# EAGLE design trb-1_v1 (EAGLE 7.4.0)
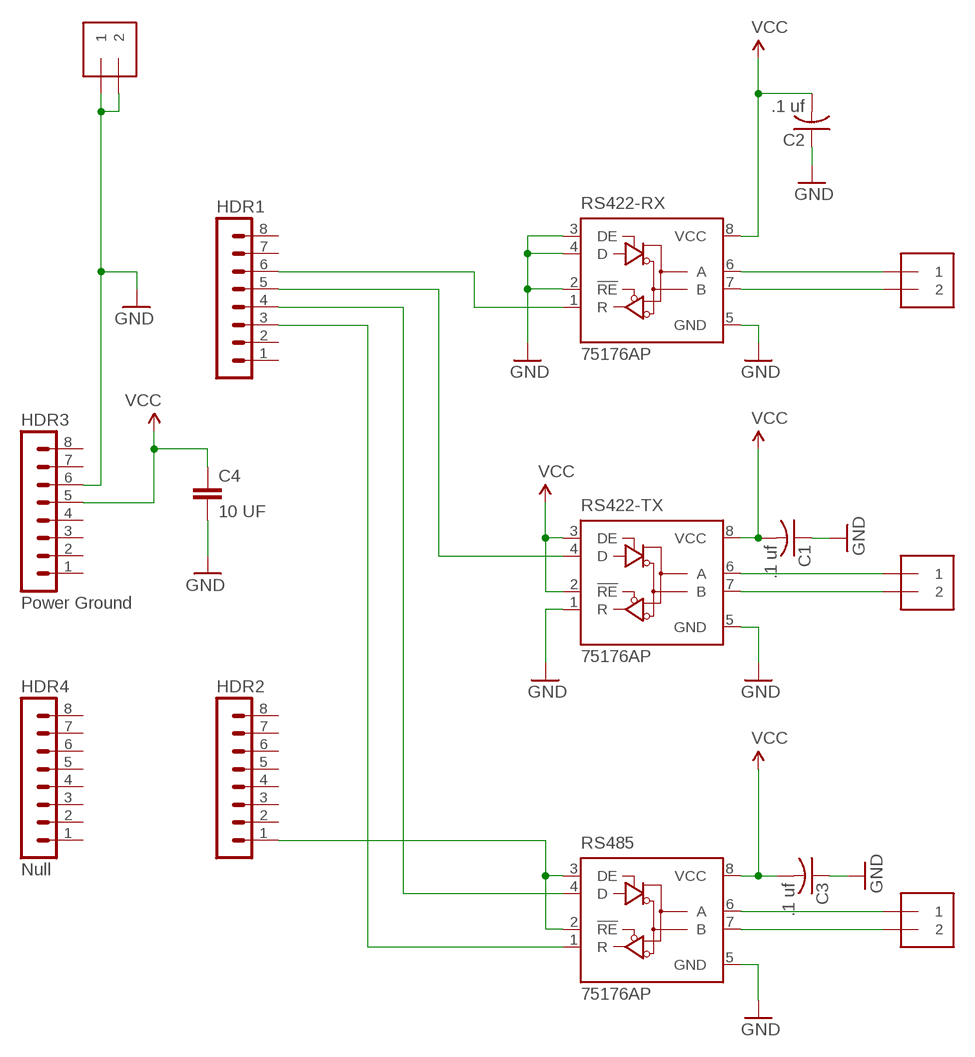
[diagram p0: schematic, sheet 1]

## Parts
C1  .1 uf  C-USC0805  [C0805]
C2  .1 uf  C-USC0805  [C0805]
C3  .1 uf  C-USC0805  [C0805]
C4  10 UF  10UF10V10%(0805)  [0805-CAP]
HDR1  MA08-1  [MA08-1]
HDR2  MA08-1  [MA08-1]
HDR3  Power Ground  MA08-1  [MA08-1]
HDR4  Null  MA08-1  [MA08-1]
J1  1X2-3.5MM  [1X2-3.5MM]
RS422-RX  75176AP  [DIL08]
RS422-RX1  1X2-3.5MM  [1X2-3.5MM]
RS422-TX  75176AP  [DIL08]
RS422-TX1  1X2-3.5MM  [1X2-3.5MM]
RS485  75176AP  [DIL08]
RS485-TXRX  1X2-3.5MM  [1X2-3.5MM]

## Nets
GND: C1.1 C2.1 C3.1 C4.2 HDR3.6 J1.1 J1.2 RS422-RX.2(!RE) RS422-RX.3(DE) RS422-RX.4(D) RS422-RX.5(GND) RS422-TX.1(R) RS422-TX.5(GND) RS485.5(GND)
N$1: HDR1.3 RS485.1(R)
N$2: HDR1.4 RS485.4(D)
N$3: HDR1.5 RS422-TX.4(D)
N$4: HDR1.6 RS422-RX.1(R)
N$5: HDR2.1 RS485.2(!RE) RS485.3(DE)
N$6: RS422-RX1.1 RS422-RX.6(A)
N$7: RS422-RX1.2 RS422-RX.7(B)
N$8: RS422-TX1.1 RS422-TX.6(A)
N$9: RS422-TX1.2 RS422-TX.7(B)
N$10: RS485-TXRX.1 RS485.6(A)
N$11: RS485-TXRX.2 RS485.7(B)
VCC: C1.2 C2.2 C3.2 C4.1 HDR3.5 RS422-RX.8(VCC) RS422-TX.2(!RE) RS422-TX.3(DE) RS422-TX.8(VCC) RS485.8(VCC)
Unconnected: HDR1.1 HDR1.2 HDR1.7 HDR1.8 HDR2.2 HDR2.3 HDR2.4 HDR2.5 HDR2.6 HDR2.7 HDR2.8 HDR3.1 HDR3.2 HDR3.3 HDR3.4 HDR3.7 HDR3.8 HDR4.1 HDR4.2 HDR4.3 HDR4.4 HDR4.5 HDR4.6 HDR4.7 HDR4.8

## Library data of the parts
C1-C3 = resistor:C-US: CAPACITOR, American symbol
C4 = SparkFun-Capacitors:10UF10V10%(0805): CAP-11330; PROD_ID: CAP-11330
HDR1-HDR4 = con-lstb:MA08-1: PIN HEADER; OC_FARNELL: unknown; OC_NEWARK: unknown
J1 RS422-RX1 RS422-TX1 RS485-TXRX = adafruit:1X2: 3.5mm Terminal block http://www.ladyada.net/library/pcb/eaglelibrary.html
RS422-RX RS422-TX RS485 = 751xx:75176A: DIFFERENTIAL BUS TRANSCEIVER Source: http://focus.ti.com/lit/ds/symlink/sn75176a.pdf; MF: TEXAS INSTRUMENTS; MPN: SN75176AP; OC_NEWARK: 08F8125

## Net classes
0 default: width 0.305 mm, drill 0.508 mm, clearance 0.305 mm

## Board
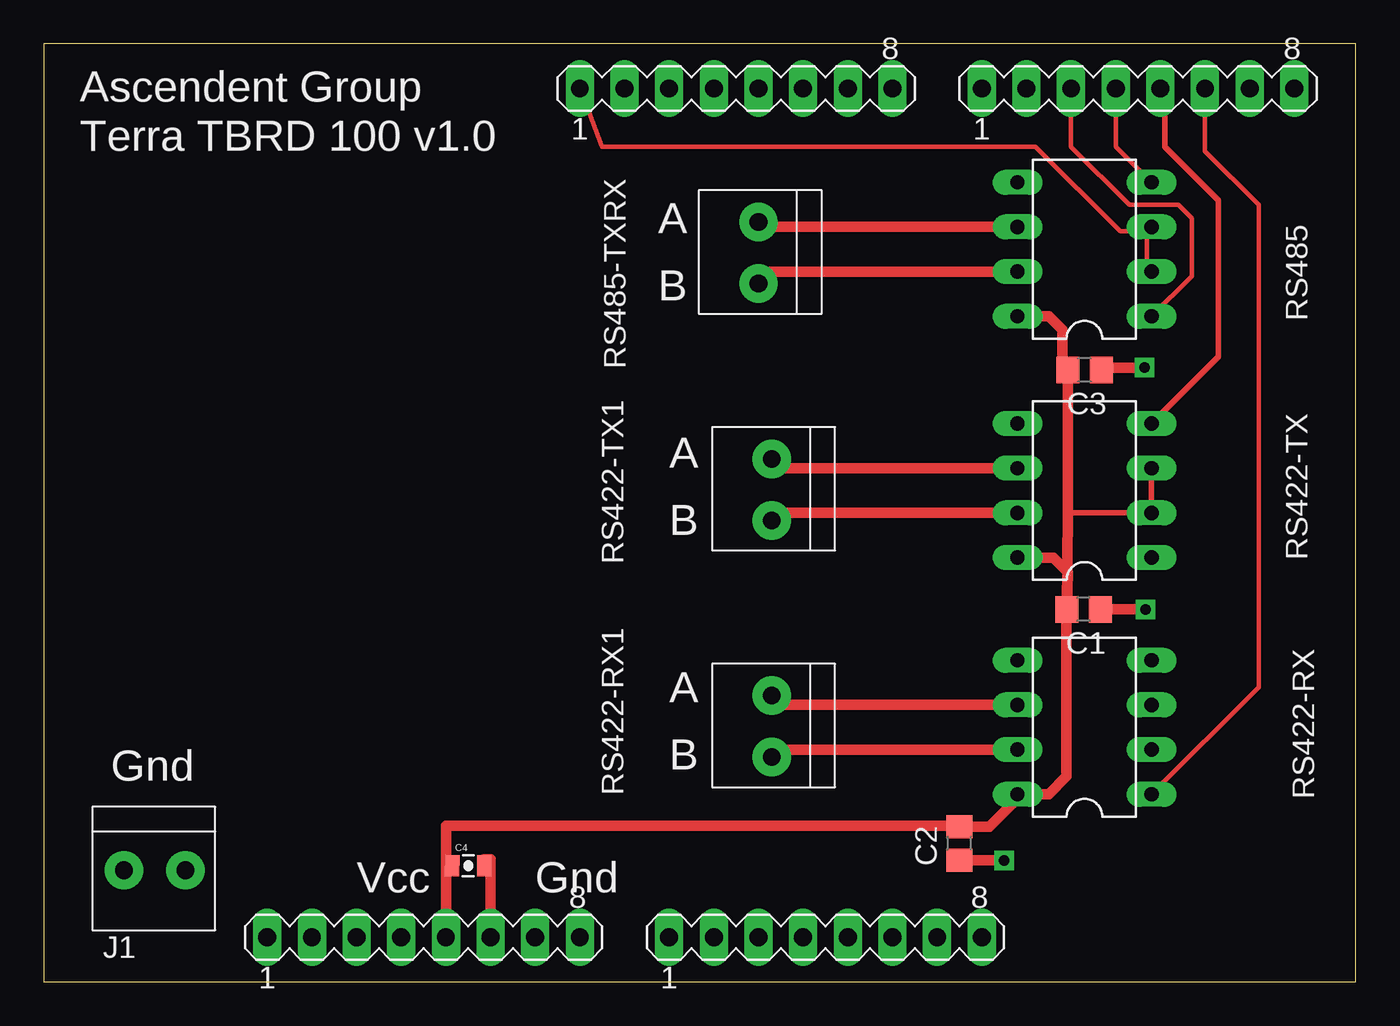
[diagram p1: board, top side]
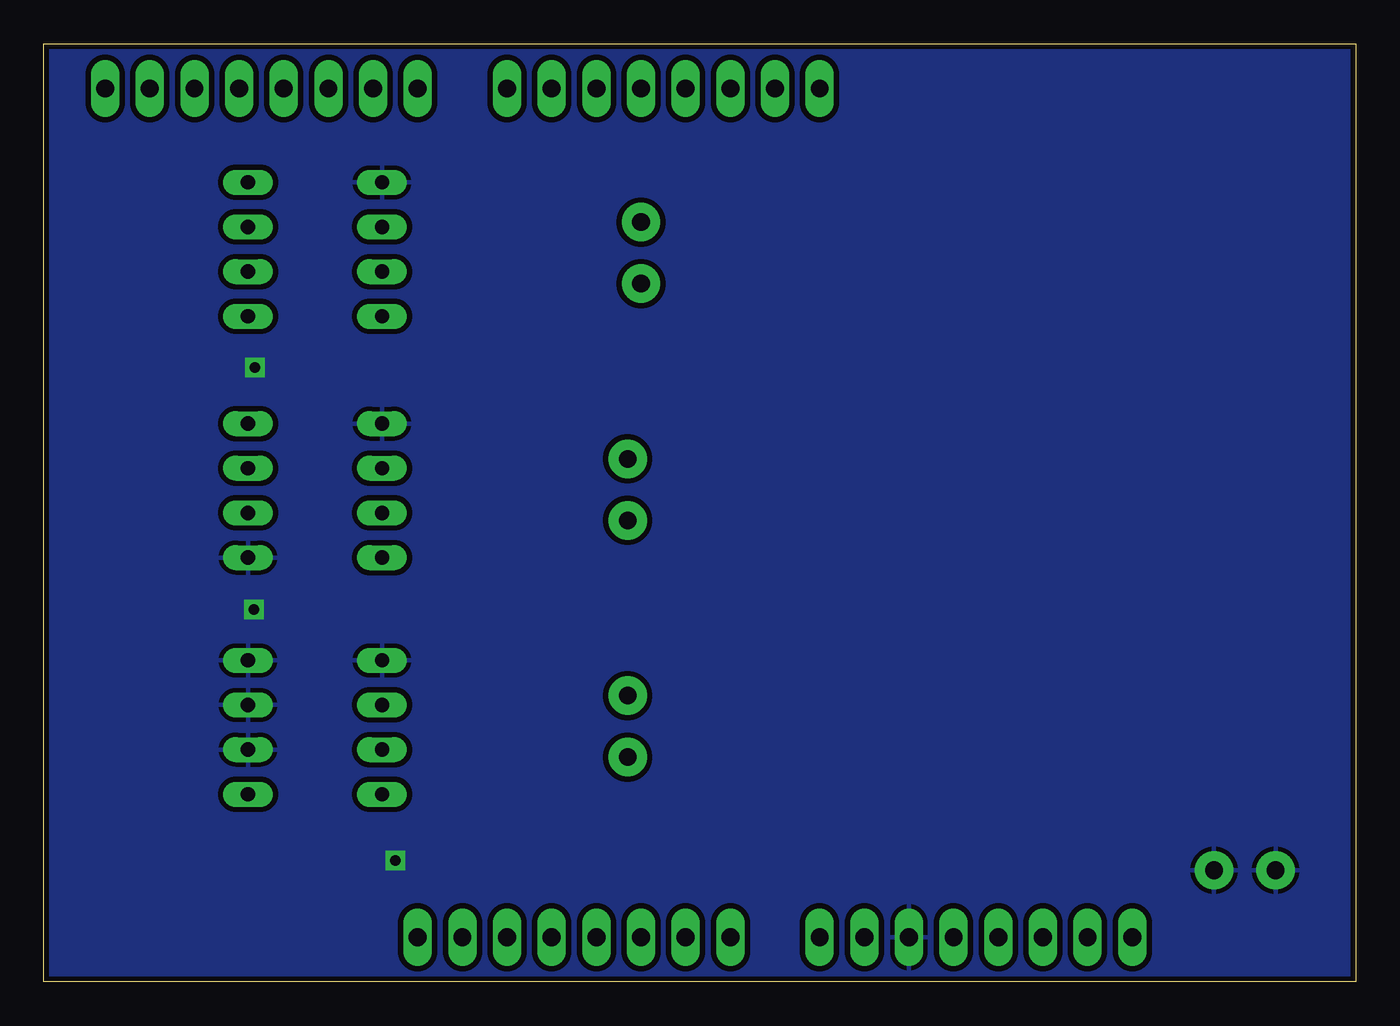
[diagram p2: board, bottom side, seen from below]

Size 74.6 x 53.33 mm. Coordinates in mm from the lower left corner, seen from the top.
Outline: 0,0 74.6,0 74.6,53.33 0,53.33 0,0
Copper layers (1*16): Top 0.035mm / dielectric 1.5mm / Bottom 0.035mm
Design rules "SparkFun": minimum track width 8mil, minimum drill 20mil, track to track 8mil, track to pad 8mil, pad to pad 8mil, via to via 8mil, smd to smd 8mil, copper to edge 10mil, drill to drill 8mil, minimum pad ring 12mil, minimum via ring 10mil, stop-mask expansion 4mil, vias tented up to drill 25mil, thermal gap 10mil

### Footprints (pad centres in the part's own frame; a part is rotated, then mirrored left to right if it is on the bottom)
C0805 = smd 1.3 x 1.5: 1 -0.95,0; 2 0.95,0
0805-CAP = smd 0.8 x 1.2: 1 -0.9,0; 2 0.9,0
MA08-1 = drill 1.016 long: 1 -8.89,0; 2 -6.35,0; 3 -3.81,0; 4 -1.27,0; 5 1.27,0; 6 3.81,0; 7 6.35,0; 8 8.89,0
1X2-3.5MM = drill 1 pad 2.184: 1 1.8,0; 2 -1.7,0
DIL08 = drill 0.813 long: 1 -3.81,-3.81; 2 -1.27,-3.81; 3 1.27,-3.81; 4 3.81,-3.81; 5 3.81,3.81; 6 1.27,3.81; 7 -1.27,3.81; 8 -3.81,3.81

### Placement (x,y rotation side)
C1  59.13,21.18 180 top
C2  52.07,7.87 90 top
C3  59.18,34.8 180 top
C4  24.13,6.6 359.4 top
HDR1  62.23,50.8 0 top
HDR2  39.37,50.8 0 top
HDR3  21.59,2.54 0 top
HDR4  44.45,2.54 0 top
J1  6.35,6.35 180 top
RS422-RX  59.18,14.48 90 top
RS422-RX1  41.4,14.48 90 top
RS422-TX  59.18,27.94 90 top
RS422-TX1  41.4,27.94 90 top
RS485  59.18,41.66 90 top
RS485-TXRX  40.64,41.4 90 top

### Tracks (layer width: path | path; a pad name or v marks a point on that pad's centre or on a via)
GND  (via drill 0.6)
  Top 0.61: C2.1 53.58,6.92 v54.61,6.91 | v62.66,21.18 C1.1 | HDR3.6 25.4,6.99 25.03,6.99 C4.2 | v62.61,34.92 60.13,34.92 C3.1
  pour Bottom (isolate 0.305): -1.27,54.61 -1.52,-1.78 76.45,-1.02 76.2,27.94 76.2,54.61
N$1
  Top 0.254: HDR1.3 58.42,47.5 61.72,44.2 64.52,44.2 65.28,43.43 65.28,40.13 RS485.1
N$2
  Top 0.254: HDR1.4 60.96,47.5 RS485.4
N$3
  Top 0.305: HDR1.5 63.75,50.8 63.75,47.5 66.8,44.45 66.8,35.56 RS422-TX.4
N$4
  Top 0.254: HDR1.6 66.04,47.24 69.09,44.2 69.09,16.76 RS422-RX.1
N$5
  Top 0.254: HDR2.1 31.75,47.5 56.39,47.5 61.21,42.67 62.74,42.67 | 62.74,42.67 RS485.3 | 62.74,42.67 62.74,40.64 RS485.2
N$6
  Top 0.61: RS422-RX.6 41.93,15.75 RS422-RX1.1
N$7
  Top 0.61: RS422-RX.7 41.83,13.21 RS422-RX1.2
N$8
  Top 0.61: RS422-TX.6 41.93,29.21 RS422-TX1.1
N$9
  Top 0.61: RS422-TX.7 41.83,26.67 RS422-TX1.2
N$10
  Top 0.61: RS485.6 40.92,42.93 RS485-TXRX.1
N$11
  Top 0.61: RS485.7 41.32,40.39 RS485-TXRX.2
VCC
  Top 0.305: 58.23,26.67 RS422-TX.2 RS422-TX.3
  Top 0.61: C1.2 58.17,21.02 58.17,11.68 57.15,10.67 RS422-RX.8 55.12,10.41 55.12,10.16 53.78,8.82 C2.2 51.51,8.77 51.51,8.89 22.86,8.89 22.86,6.61 | C1.2 58.23,23.3 57.4,24.13 RS422-TX.8 | C1.2 58.23,26.67 58.23,34.48 57.91,34.8 | 57.91,34.8 57.91,37.08 57.15,37.85 RS485.8 | 57.91,34.8 C3.2 | HDR3.5 22.86,6.61 | C4.1 22.86,6.61
  Bottom 0.813: HDR3.5 22.86,2.29

### Text on the board
tPlace: Ascendent Group | Terra TBRD 100 v1.0 | A | B | A | B | A | B | Gnd | Vcc | Gnd